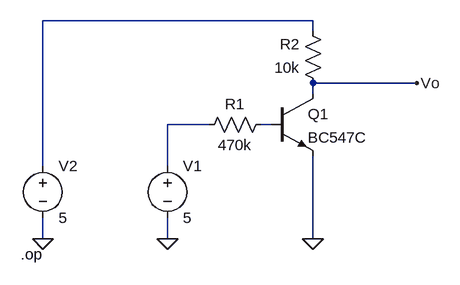
[diagram p0: schematic rtl.asc]
rtl.asc, the LTspice schematic file:
Version 4
SHEET 1 880 680
WIRE 240 -16 -176 -16
WIRE 240 0 240 -16
WIRE 400 80 240 80
WIRE 240 96 240 80
WIRE 80 144 16 144
WIRE 176 144 160 144
WIRE -176 208 -176 -16
WIRE 16 208 16 144
WIRE -176 320 -176 288
WIRE 16 320 16 288
WIRE 240 320 240 192
FLAG -176 320 0
FLAG 16 320 0
FLAG 240 320 0
FLAG 400 80 Vo
SYMBOL npn 176 96 R0
SYMATTR InstName Q1
SYMATTR Value BC547C
SYMBOL res 176 128 R90
WINDOW 0 0 56 VBottom 2
WINDOW 3 32 56 VTop 2
SYMATTR InstName R1
SYMATTR Value 470k
SYMBOL res 256 96 R180
WINDOW 0 36 76 Left 2
WINDOW 3 36 40 Left 2
SYMATTR InstName R2
SYMATTR Value 10k
SYMBOL voltage 16 192 R0
WINDOW 123 0 0 Left 0
WINDOW 39 0 0 Left 0
SYMATTR InstName V1
SYMATTR Value 5
SYMBOL voltage -176 192 R0
WINDOW 123 0 0 Left 0
WINDOW 39 0 0 Left 0
SYMATTR InstName V2
SYMATTR Value 5
TEXT -210 344 Left 2 !.op

The netlist it stands for:
* rtl.asc
Q1 Vo N003 0 0 BC547C
R1 N003 N002 470k
R2 Vo N001 10k
V1 N002 0 5
V2 N001 0 5
.model NPN NPN
.model PNP PNP
.lib standard.bjt
.op
.backanno
.end